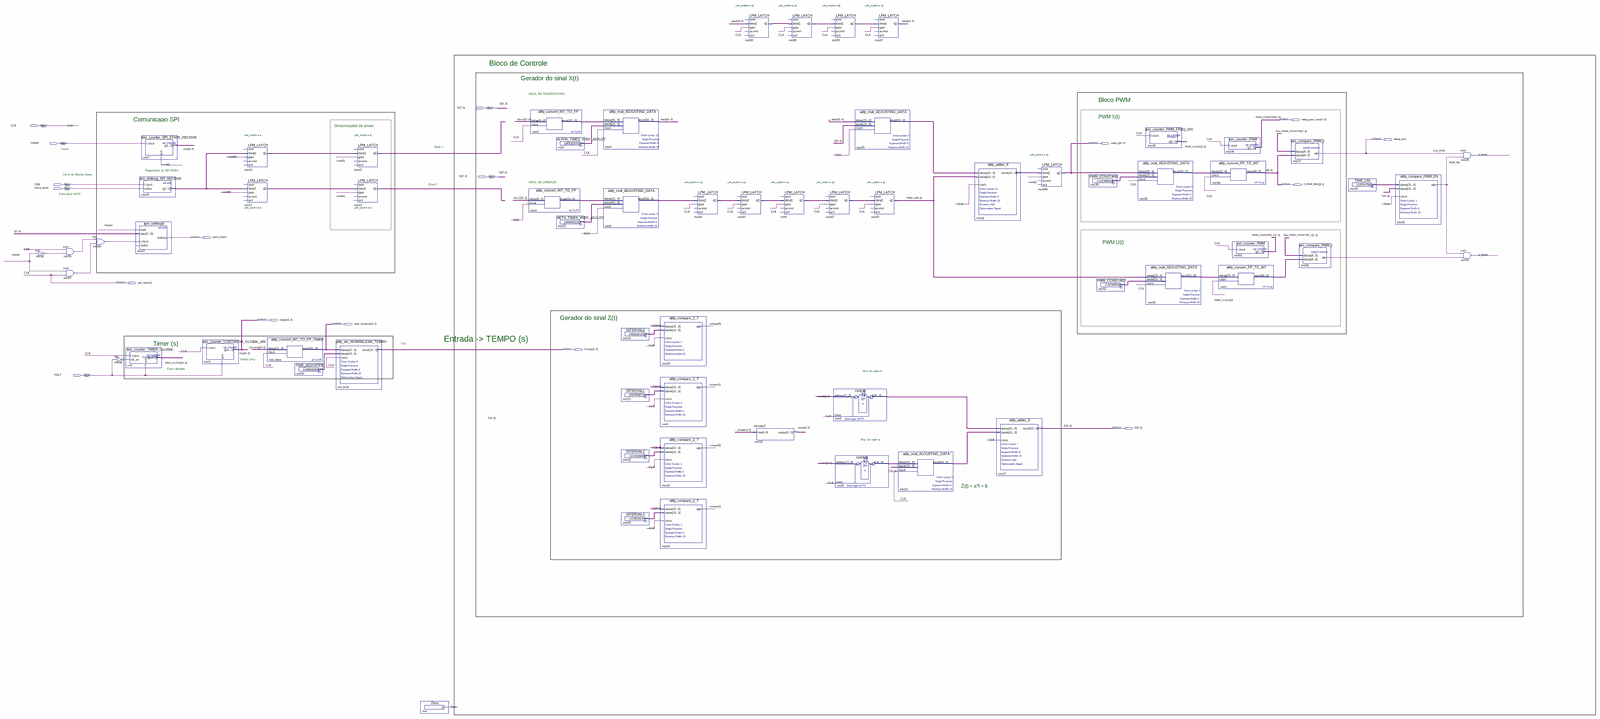
[diagram p0: schematic sheet, whole]
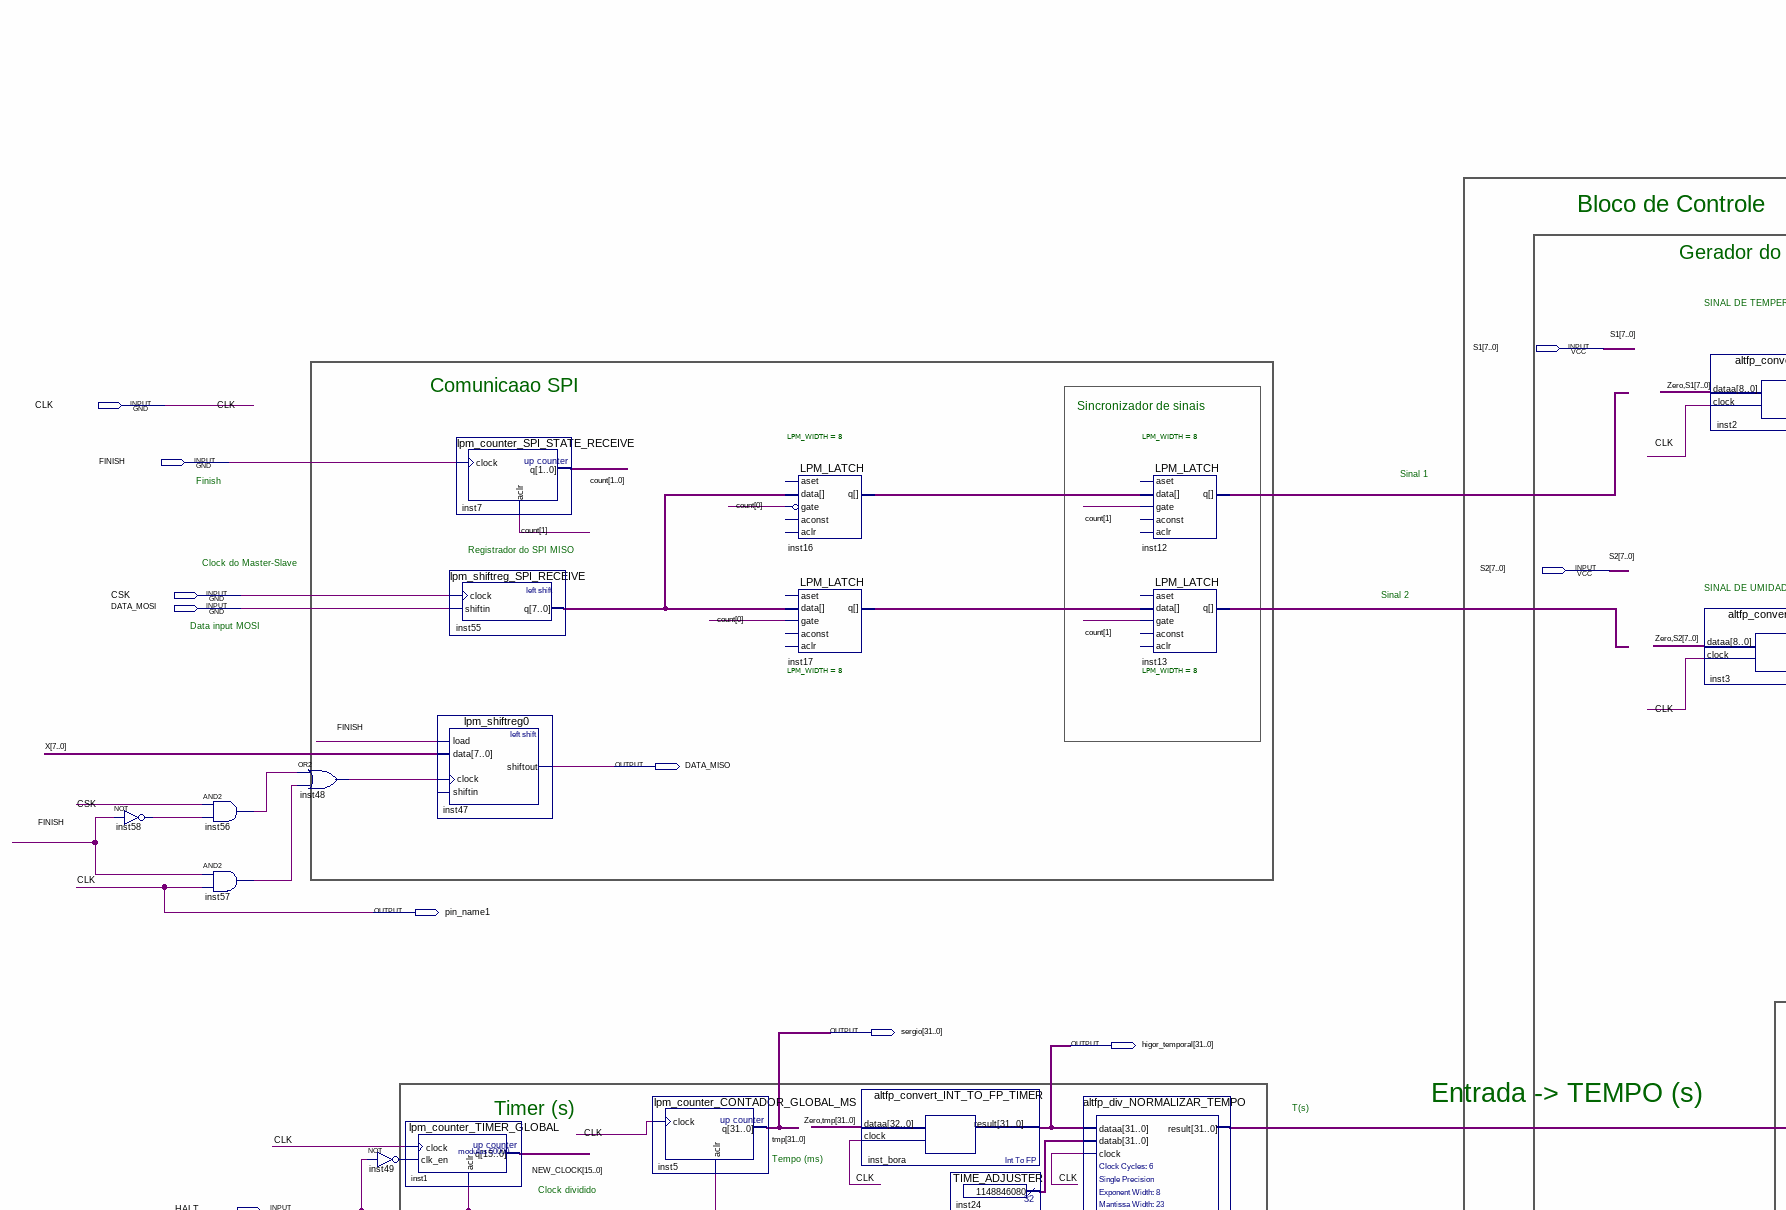
[diagram p1: schematic sheet, upper left part]
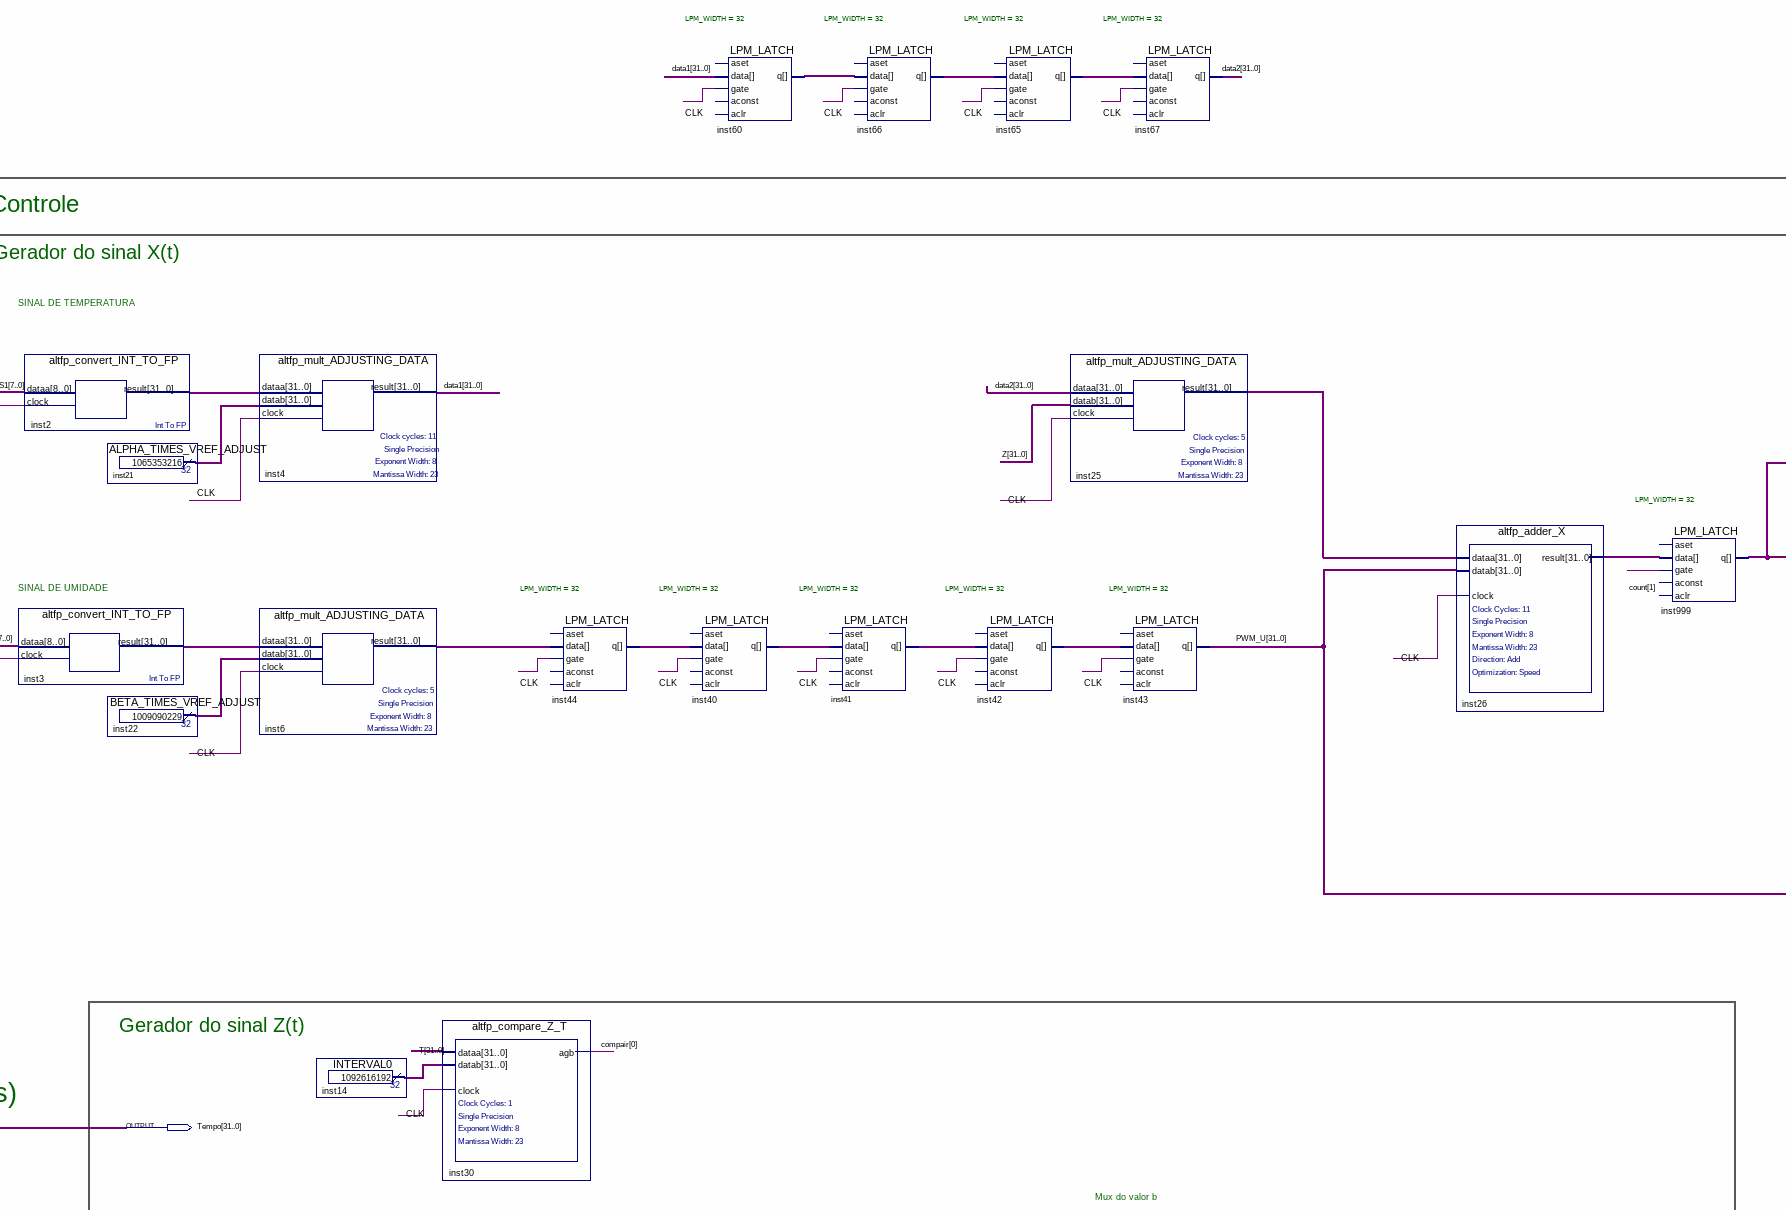
[diagram p2: schematic sheet, upper centre part]
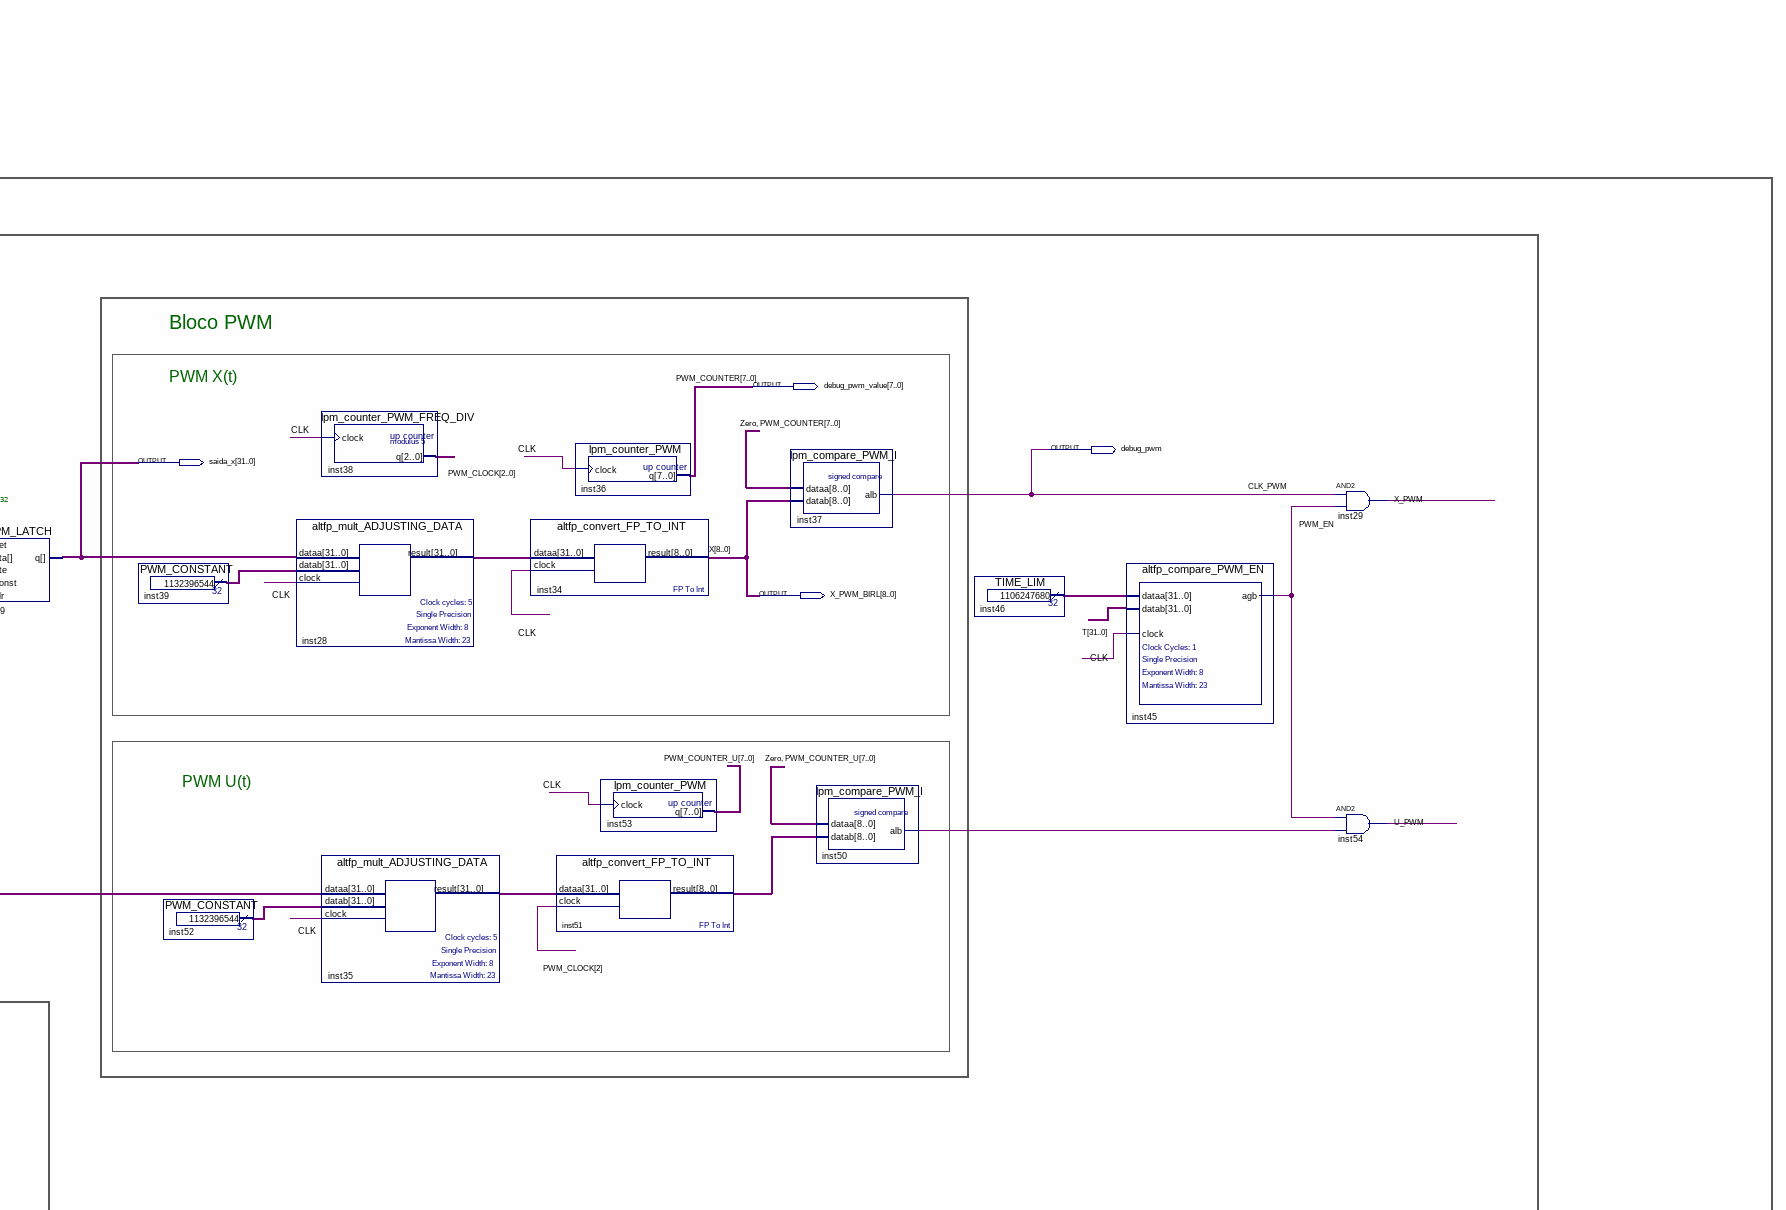
[diagram p3: schematic sheet, upper right part]
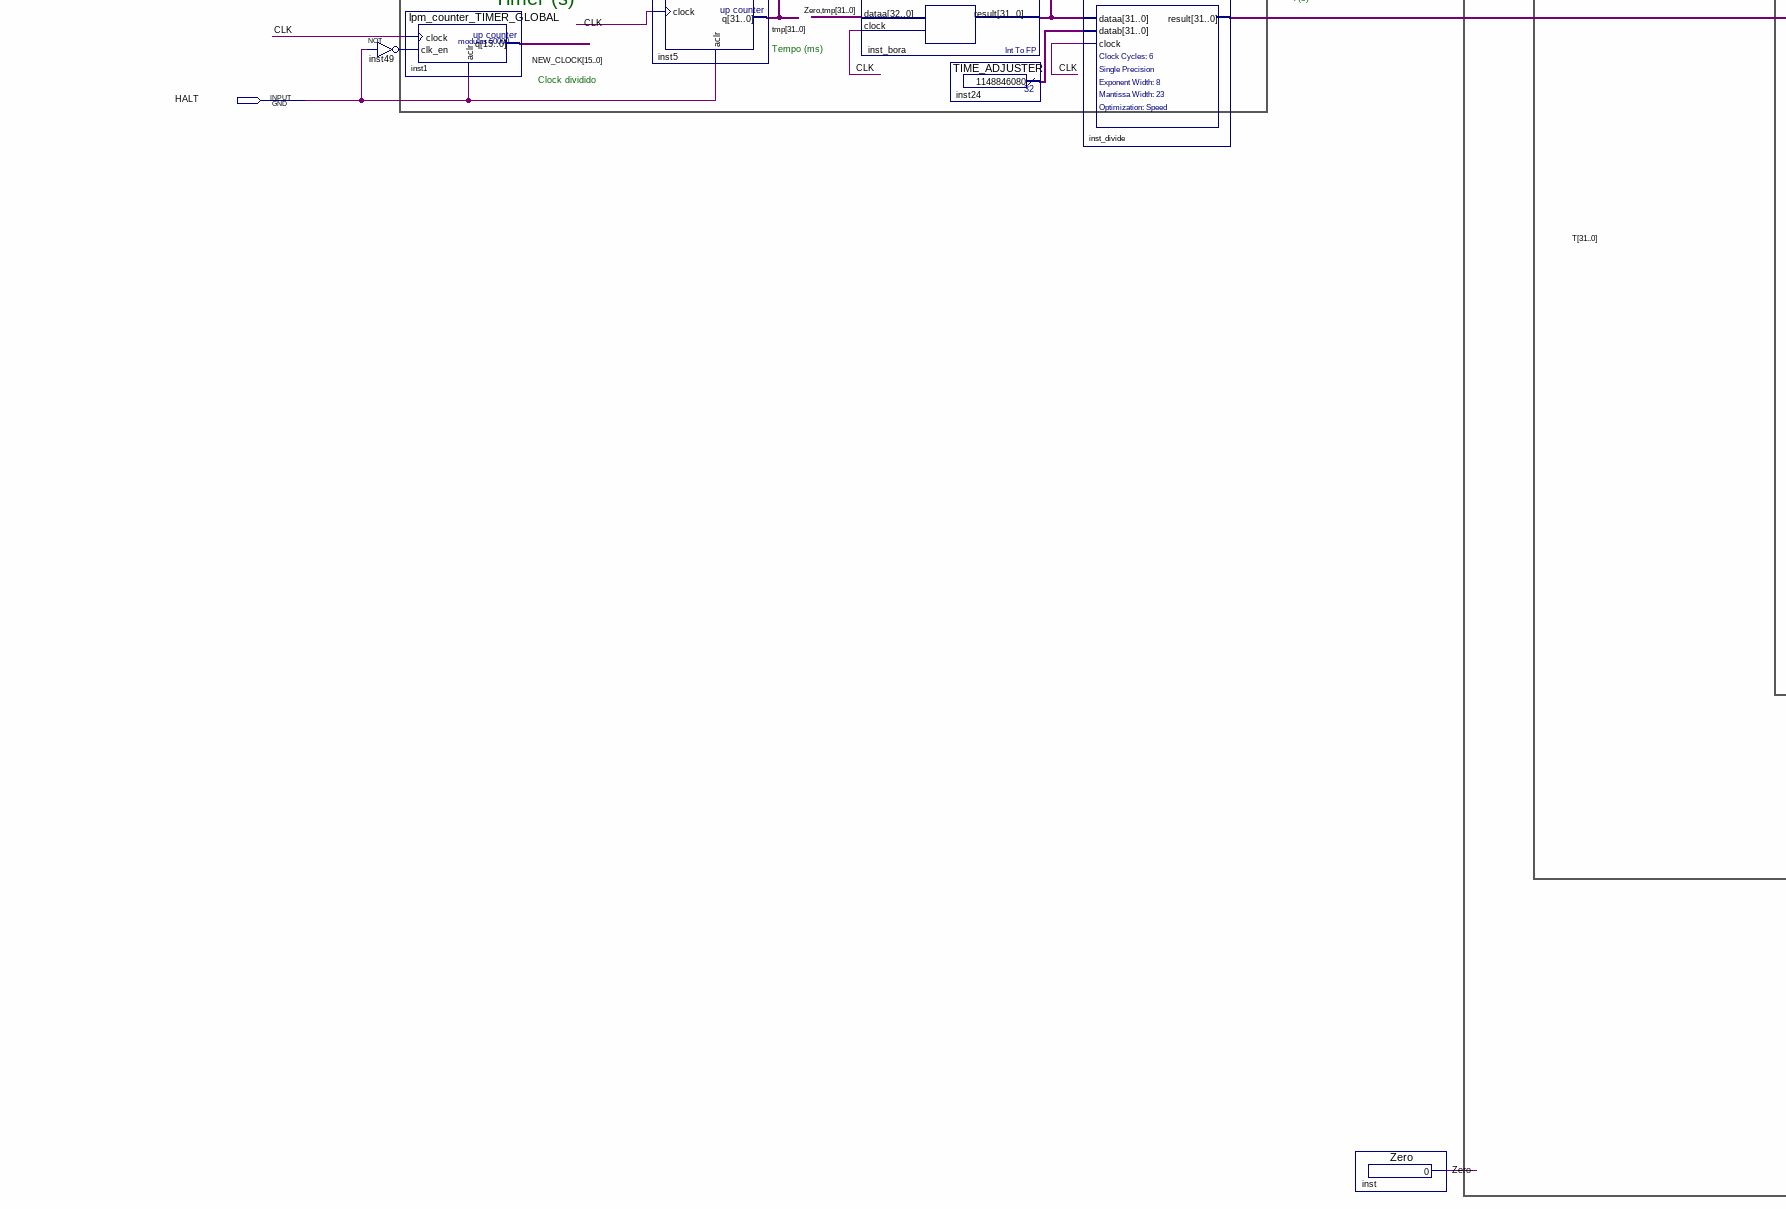
[diagram p4: schematic sheet, lower left part]
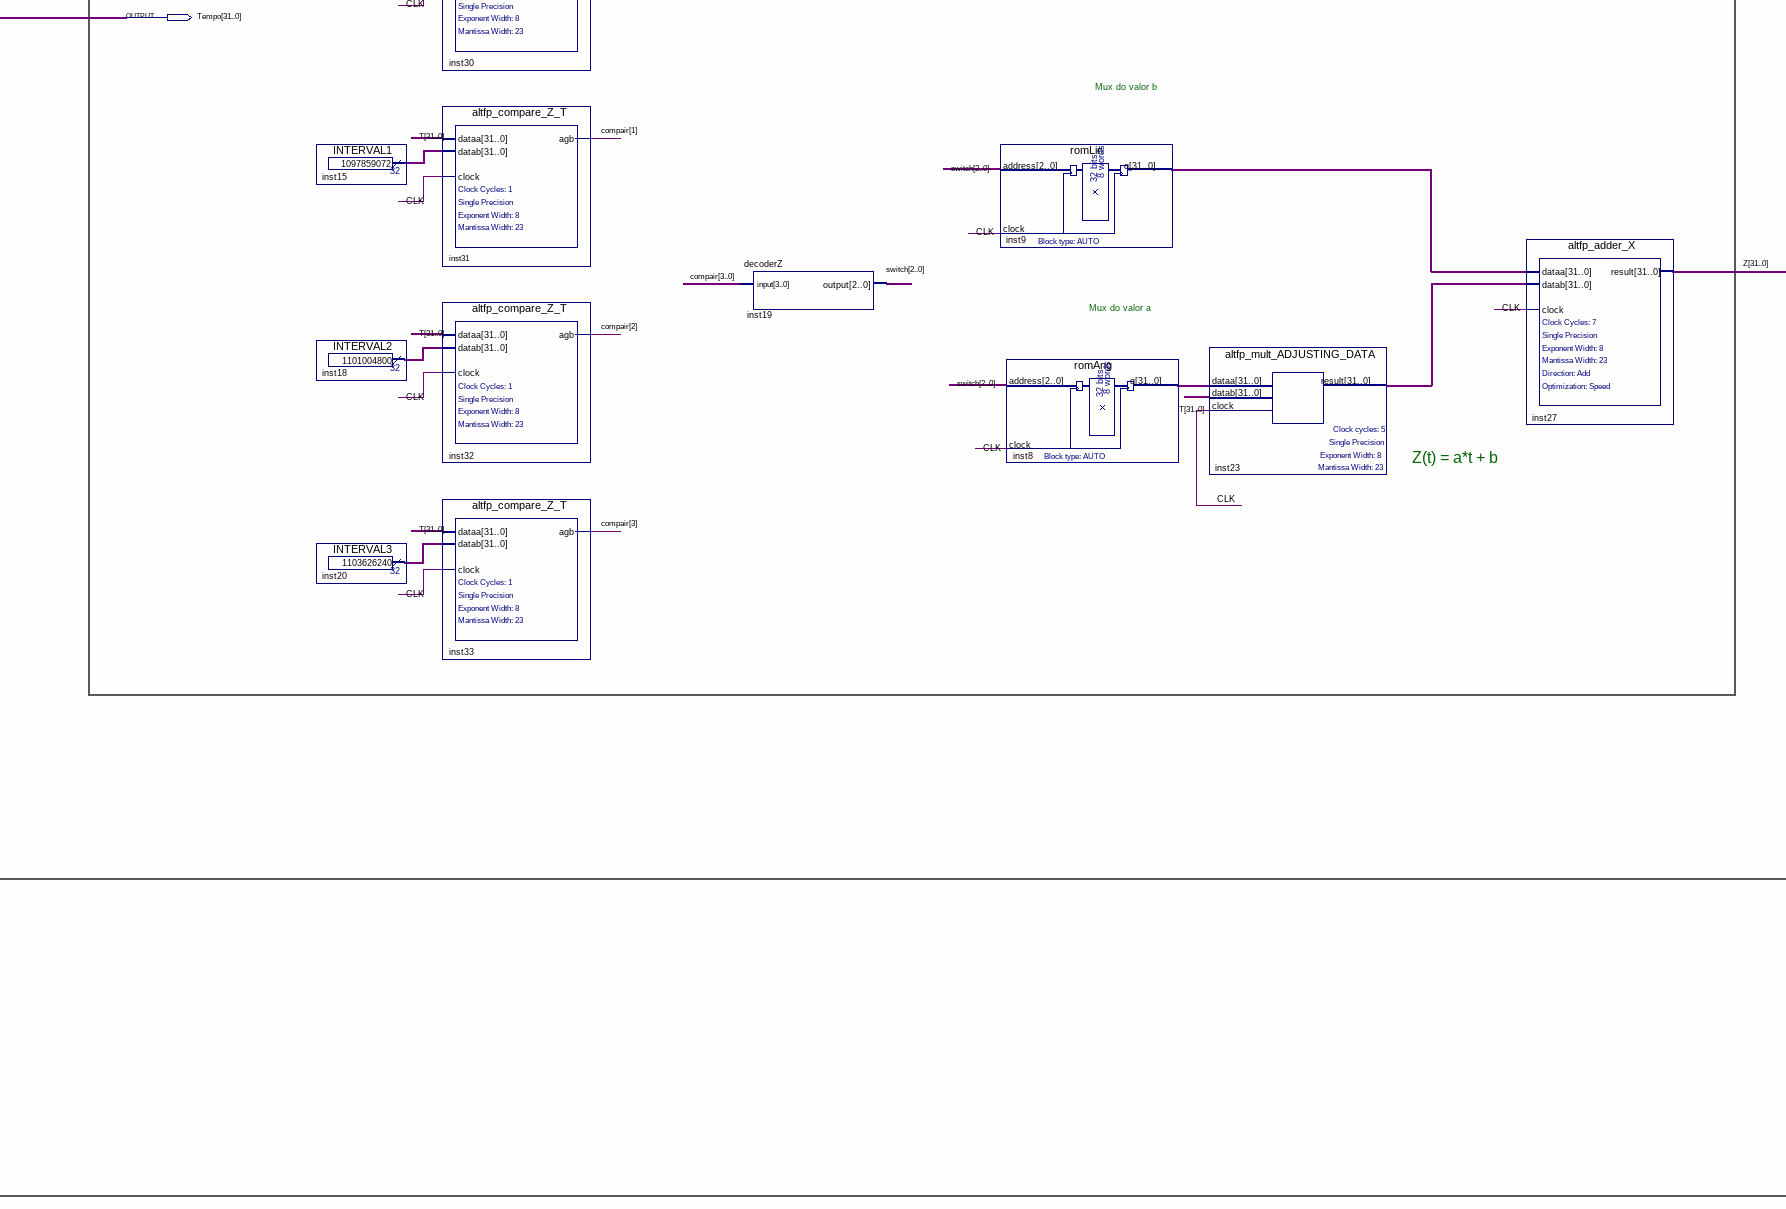
[diagram p5: schematic sheet, lower centre part]
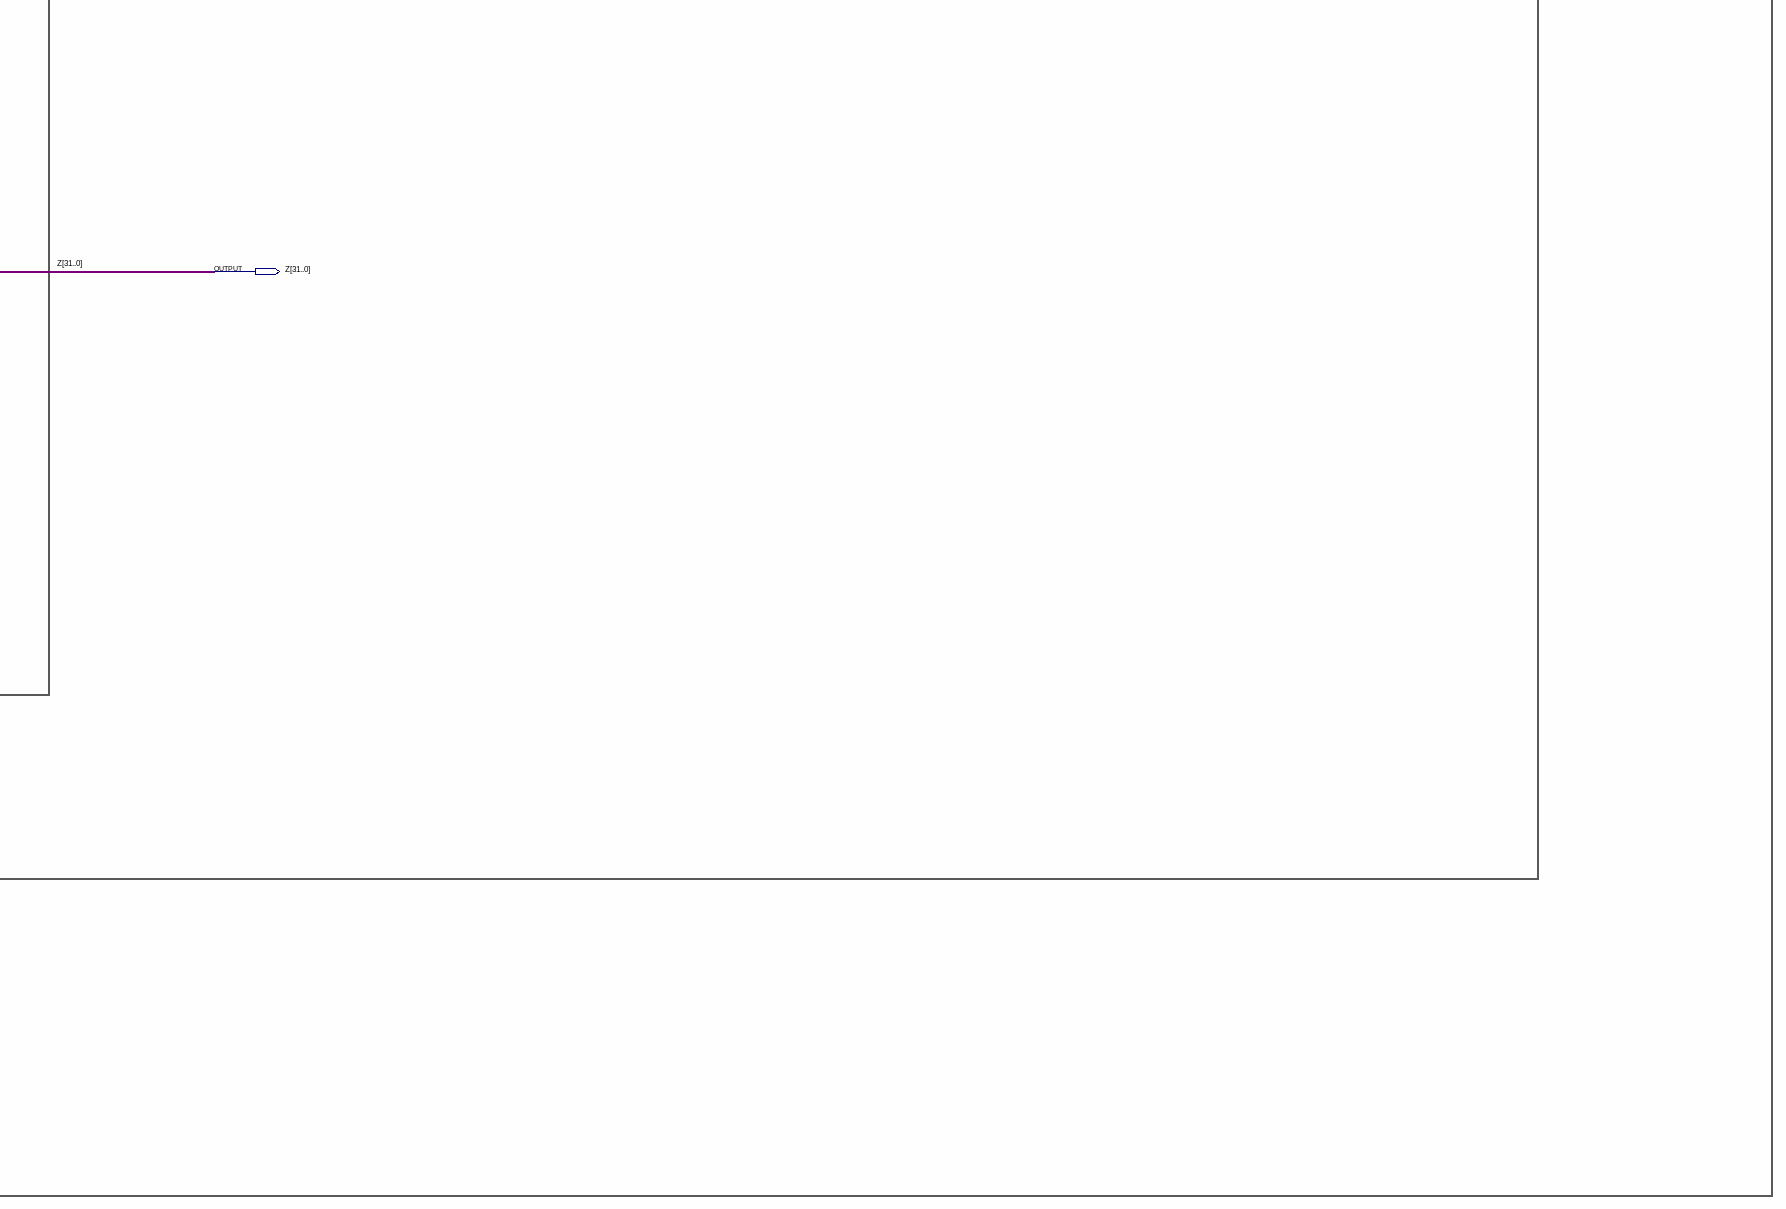
[diagram p6: schematic sheet, lower right part]
// Quartus schematic Secador.bdf as structural Verilog: 64 symbols, 17 pins
module Secador (
  input  [7:0] S1,
  input  CLK,
  input  FINISH,
  input  [7:0] S2,
  input  CSK,
  input  DATA_MOSI,
  input  HALT,
  output [7:0] debug_pwm_value,
  output debug_pwm,
  output [31:0] saida_x,
  output [8:0] X_PWM_BIRL,
  output DATA_MISO,
  output pin_name1,
  output [31:0] sergio,
  output [31:0] higor_temporal,
  output [31:0] Tempo,
  output [31:0] Z
);

  wire inst48_out, inst49_out, inst50_alb, inst56_out, inst57_out, inst58_out, PWM_EN, U_PWM, X_PWM, Zero;
  wire [1:0] count;
  wire [2:0] PWM_CLOCK, switch;
  wire [3:0] compair;
  wire [7:0] inst12_q, inst13_q, inst16_q, inst17_q, inst55_q, PWM_COUNTER_U;
  wire [8:0] inst51_result;
  wire [15:0] NEW_CLOCK;
  wire [31:0] data1, data2, inst2_result, inst3_result, inst6_result, inst8_q, inst9_q, inst14_result,
       inst15_result, inst18_result, inst20_result, inst21_result, inst22_result, inst23_result,
       inst24_result, inst25_result, inst26_result, inst28_result, inst35_result, inst39_result, inst40_q,
       inst41_q, inst42_q, inst44_q, inst46_result, inst52_result, inst60_q, inst65_q, inst66_q, PWM_U;

  not inst58 (inst58_out, FINISH);
  and inst56 (inst56_out, CSK, inst58_out);
  and inst57 (inst57_out, FINISH, CLK);
  or inst48 (inst48_out, inst56_out, inst57_out);
  lpm_counter_TIMER_GLOBAL inst1 (.clock(CLK), .clk_en(inst49_out), .aclr(HALT), .q(NEW_CLOCK));
  not inst49 (inst49_out, HALT);
  lpm_counter_SPI_STATE_RECEIVE inst7 (.clock(FINISH), .aclr(count[1]), .q(count));
  lpm_shiftreg_SPI_RECEIVE inst55 (.clock(CSK), .shiftin(DATA_MOSI), .q(inst55_q));
  lpm_shiftreg0 inst47 (
    .load(FINISH), .data(X_PWM_BIRL[7:0]), .clock(inst48_out), .shiftout(DATA_MISO));  // open: shiftin
  lpm_counter_CONTADOR_GLOBAL_MS inst5 (.clock(CLK), .aclr(HALT), .q(sergio));
  LPM_LATCH #(.LPM_WIDTH(8)) inst16 (.data(inst55_q), .gate(~count[0]), .q(inst16_q));  // open: aset, aconst, aclr
  LPM_LATCH #(.LPM_WIDTH(8)) inst17 (.data(inst55_q), .gate(count[0]), .q(inst17_q));  // open: aset, aconst, aclr
  altfp_convert_INT_TO_FP_TIMER inst_bora (.dataa({Zero, sergio}), .clock(CLK), .result(higor_temporal));
  TIME_ADJUSTER inst24 (.result(inst24_result));
  altfp_div_NORMALIZAR_TEMPO inst_divide (.dataa(higor_temporal), .datab(inst24_result), .clock(CLK), .result(Tempo));
  LPM_LATCH #(.LPM_WIDTH(8)) inst12 (.data(inst16_q), .gate(count[1]), .q(inst12_q));  // open: aset, aconst, aclr
  LPM_LATCH #(.LPM_WIDTH(8)) inst13 (.data(inst17_q), .gate(count[1]), .q(inst13_q));  // open: aset, aconst, aclr
  Zero inst (.result(Zero));
  altfp_convert_INT_TO_FP inst2 (.dataa({Zero, S1}), .clock(CLK), .result(inst2_result));
  altfp_convert_INT_TO_FP inst3 (.dataa({Zero, S2}), .clock(CLK), .result(inst3_result));
  ALPHA_TIMES_VREF_ADJUST inst21 (.result(inst21_result));
  BETA_TIMES_VREF_ADJUST inst22 (.result(inst22_result));
  altfp_mult_ADJUSTING_DATA inst4 (.dataa(inst2_result), .datab(inst21_result), .clock(CLK), .result(data1));
  altfp_mult_ADJUSTING_DATA inst6 (.dataa(inst3_result), .datab(inst22_result), .clock(CLK), .result(inst6_result));
  INTERVAL0 inst14 (.result(inst14_result));
  INTERVAL1 inst15 (.result(inst15_result));
  INTERVAL2 inst18 (.result(inst18_result));
  INTERVAL3 inst20 (.result(inst20_result));
  altfp_compare_Z_T inst30 (.dataa(Tempo), .datab(inst14_result), .clock(CLK), .agb(compair[0]));
  altfp_compare_Z_T inst31 (.dataa(Tempo), .datab(inst15_result), .clock(CLK), .agb(compair[1]));
  altfp_compare_Z_T inst32 (.dataa(Tempo), .datab(inst18_result), .clock(CLK), .agb(compair[2]));
  altfp_compare_Z_T inst33 (.dataa(Tempo), .datab(inst20_result), .clock(CLK), .agb(compair[3]));
  LPM_LATCH #(.LPM_WIDTH(32)) inst44 (.data(inst6_result), .gate(CLK), .q(inst44_q));  // open: aset, aconst, aclr
  LPM_LATCH #(.LPM_WIDTH(32)) inst40 (.data(inst44_q), .gate(CLK), .q(inst40_q));  // open: aset, aconst, aclr
  LPM_LATCH #(.LPM_WIDTH(32)) inst60 (.data(data1), .gate(CLK), .q(inst60_q));  // open: aset, aconst, aclr
  decoderZ inst19 (.\input (compair), .\output (switch));
  LPM_LATCH #(.LPM_WIDTH(32)) inst66 (.data(inst60_q), .gate(CLK), .q(inst66_q));  // open: aset, aconst, aclr
  LPM_LATCH #(.LPM_WIDTH(32)) inst41 (.data(inst40_q), .gate(CLK), .q(inst41_q));  // open: aset, aconst, aclr
  LPM_LATCH #(.LPM_WIDTH(32)) inst65 (.data(inst66_q), .gate(CLK), .q(inst65_q));  // open: aset, aconst, aclr
  LPM_LATCH #(.LPM_WIDTH(32)) inst42 (.data(inst41_q), .gate(CLK), .q(inst42_q));  // open: aset, aconst, aclr
  romLin inst9 (.address(switch), .clock(CLK), .q(inst9_q));
  romAng inst8 (.address(switch), .clock(CLK), .q(inst8_q));
  altfp_mult_ADJUSTING_DATA inst25 (.dataa(data2), .datab(Z), .clock(CLK), .result(inst25_result));
  LPM_LATCH #(.LPM_WIDTH(32)) inst67 (.data(inst65_q), .gate(CLK), .q(data2));  // open: aset, aconst, aclr
  LPM_LATCH #(.LPM_WIDTH(32)) inst43 (.data(inst42_q), .gate(CLK), .q(PWM_U));  // open: aset, aconst, aclr
  altfp_mult_ADJUSTING_DATA inst23 (.dataa(inst8_q), .datab(Tempo), .clock(CLK), .result(inst23_result));
  altfp_adder_X inst26 (.dataa(inst25_result), .datab(PWM_U), .clock(CLK), .result(inst26_result));
  altfp_adder_X inst27 (.dataa(inst9_q), .datab(inst23_result), .clock(CLK), .result(Z));
  LPM_LATCH #(.LPM_WIDTH(32)) inst999 (.data(inst26_result), .gate(count[1]), .q(saida_x));  // open: aset, aconst, aclr
  PWM_CONSTANT inst39 (.result(inst39_result));
  PWM_CONSTANT inst52 (.result(inst52_result));
  lpm_counter_PWM_FREQ_DIV inst38 (.clock(CLK), .q(PWM_CLOCK));
  altfp_mult_ADJUSTING_DATA inst28 (.dataa(saida_x), .datab(inst39_result), .clock(CLK), .result(inst28_result));
  altfp_mult_ADJUSTING_DATA inst35 (.dataa(PWM_U), .datab(inst52_result), .clock(CLK), .result(inst35_result));
  altfp_convert_FP_TO_INT inst34 (.dataa(inst28_result), .clock(CLK), .result(X_PWM_BIRL));
  lpm_counter_PWM inst36 (.clock(CLK), .q(debug_pwm_value));
  altfp_convert_FP_TO_INT inst51 (.dataa(inst35_result), .clock(PWM_CLOCK[2]), .result(inst51_result));
  lpm_counter_PWM inst53 (.clock(CLK), .q(PWM_COUNTER_U));
  lpm_compare_PWM_I inst37 (.dataa({Zero, debug_pwm_value}), .datab(X_PWM_BIRL), .alb(debug_pwm));
  lpm_compare_PWM_I inst50 (.dataa({Zero, PWM_COUNTER_U}), .datab(inst51_result), .alb(inst50_alb));
  TIME_LIM inst46 (.result(inst46_result));
  altfp_compare_PWM_EN inst45 (.dataa(inst46_result), .datab(Tempo), .clock(CLK), .agb(PWM_EN));
  and inst29 (X_PWM, debug_pwm, PWM_EN);
  and inst54 (U_PWM, PWM_EN, inst50_alb);

  assign pin_name1 = CLK;

  // Other names for the same wires on the sheet: CLK_PWM = debug_pwm; PWM_COUNTER[7:0] = debug_pwm_value;
  //   tmp[31:0] = sergio; T[31:0] = Tempo; X[8:0] = X_PWM_BIRL

  // Notes on the sheet:
  //   Bloco de Controle
  //   Gerador do sinal X(t)
  //   SINAL DE TEMPERATURA
  //   Bloco PWM
  //   PWM X(t)
  //   Comunicaao SPI
  //   Sincronizador de sinais
  //   Sinal 1
  //   Finish
  //   Registrador do SPI MISO
  //   Clock do Master-Slave
  //   SINAL DE UMIDADE
  //   Sinal 2
  //   Data input MOSI
  //   PWM U(t)
  //   Gerador do sinal Z(t)
  //   Entrada -> TEMPO (s)
  //   Timer (s)
  //   T(s)
  //   Tempo (ms)
  //   Clock dividido
  //   Mux do valor b
  //   Mux do valor a
  //   Z(t) = a*t + b
endmodule
